# Altium schematic sheet eBox_Peripherals.SchDoc: eBox_Peripherals
size A4; DocumentNumber: 4; SheetNumber: 4; SheetTotal: 9
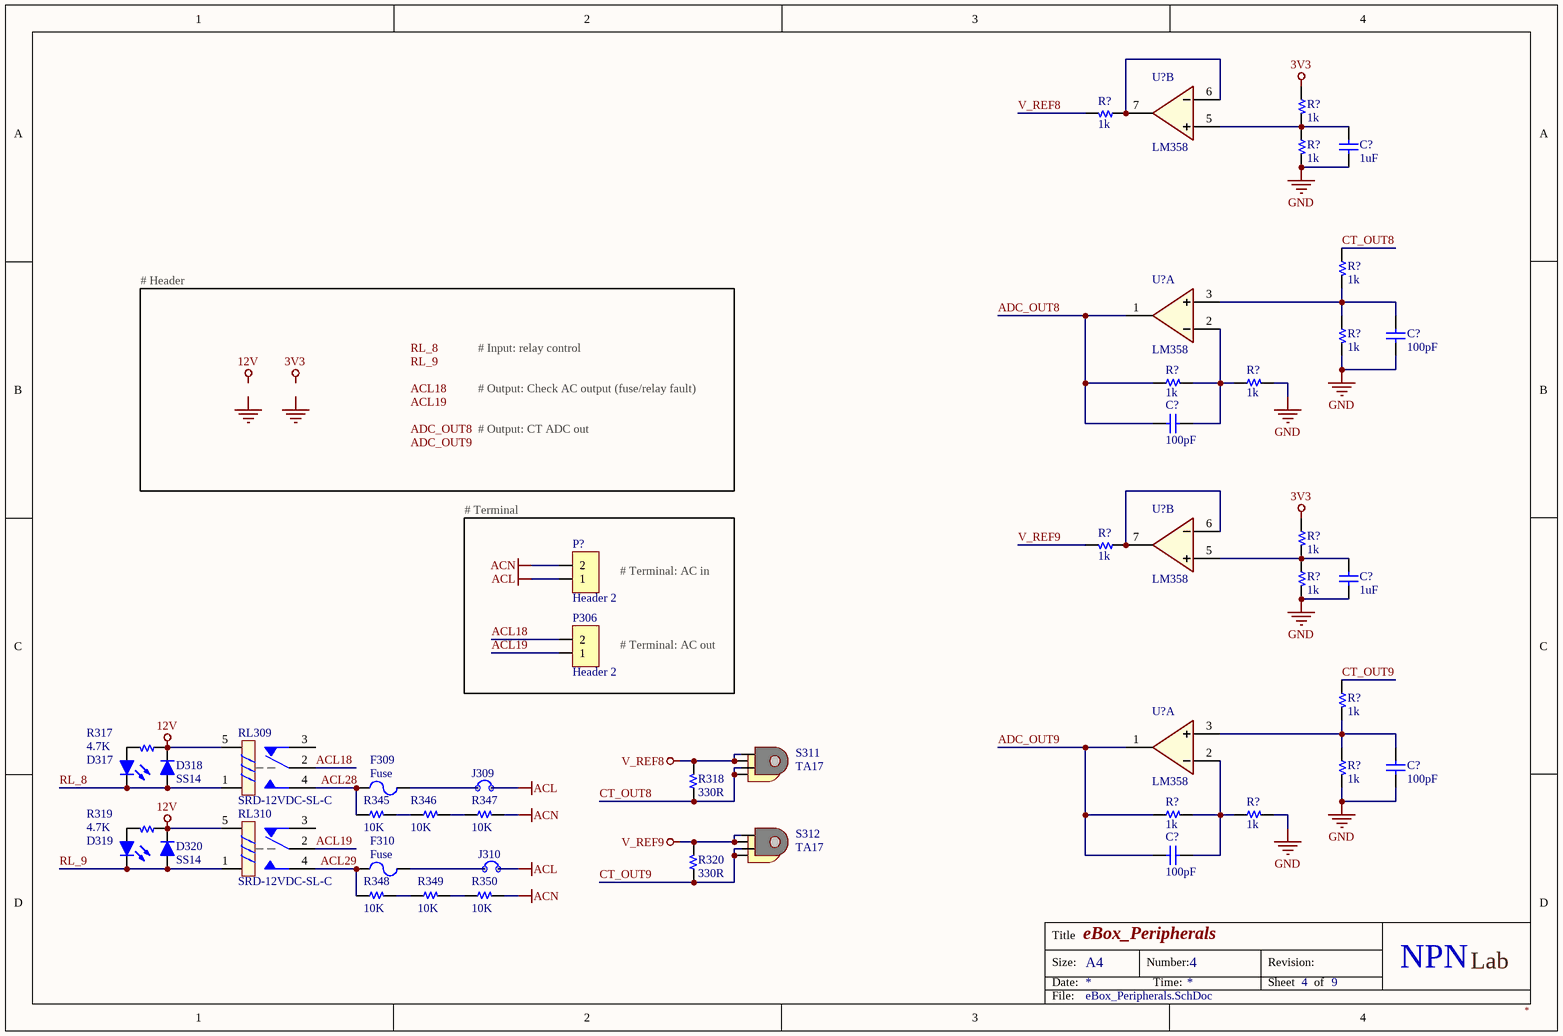
[diagram p0: eBox_Peripherals.SchDoc]

## Parts
(Parts that share a designator on the sheet are numbered #1, #2 ... from top to bottom, then left to right.)
C?#1  1uF  [C 0603]
C?#2  100pF  [C 0603]
C?#3  100pF  [C 0603]
C?#4  1uF  [C 0603]
C?#5  100pF  [C 0603]
C?#6  100pF  [C 0603]
D317  Led  [LED 3MM - green]  (value not drawn)
D318  SS14  [DO-214AC (SMA) L]
D319  Led  [LED 3MM - green]  (value not drawn)
D320  SS14  [DO-214AC (SMA) L]
F309  Fuse  [FUSE 2 DIP 0520 BOX]
F310  Fuse  [FUSE 2 DIP 0520 BOX]
J309  JUMP 2 CUSTOM  [JUMP/2/Custom]  (value not drawn)  (no BOM)
J310  JUMP 2 CUSTOM  [JUMP/2/Custom]  (value not drawn)  (no BOM)
P306  Header 2  [HDR/Terminal/2/10mm]
P?  Header 2  [HDR/Terminal/2/10mm]
R317  4.7K  [R 0805]
R318  330R  [R 0805]
R319  4.7K  [R 0805]
R320  330R  [R 0805]
R345  10K  [R 1206]
R346  10K  [R 1206]
R347  10K  [R 1206]
R348  10K  [R 1206]
R349  10K  [R 1206]
R350  10K  [R 1206]
R?#1  1k  [R 0603]
R?#2  1k  [R 0603]
R?#3  1k  [R 0603]
R?#4  1k  [R 0603]
R?#5  1k  [R 0603]
R?#6  1k  [R 0603]
R?#7  1k  [R 0603]
R?#8  1k  [R 0603]
R?#9  1k  [R 0603]
R?#10  1k  [R 0603]
R?#11  1k  [R 0603]
R?#12  1k  [R 0603]
R?#13  1k  [R 0603]
R?#14  1k  [R 0603]
RL309  SRD-12VDC-SL-C  [RL_SPDT_10A]
RL310  SRD-12VDC-SL-C  [RL_SPDT_10A]
S309  TA12-200  [TA12]  (value not drawn)
S310  NA  [TA12]  (value not drawn)
S311  TA17  [TA17]
S312  TA17  [TA17]
U?#1  LM358  [SOIC-8]  (part B of 2)
U?#2  LM358  [SOIC-8]  (part A of 2)
U?#3  LM358  [SOIC-8]  (part B of 2)
U?#4  LM358  [SOIC-8]  (part A of 2)

## Nets
3V3: R?#2.2 R?#9.2
12V: D318.2(K) D320.2(K) R317.1 R319.1 RL309.5(COIL2) RL310.5(COIL2)
ACL: J309.2 J310.2 P?.1
ACN: P?.2 R347.2 R350.2
GND: C?#1.2 C?#2.2 C?#4.2 C?#5.2 R?#3.1 R?#5.1 R?#7.2 R?#10.1 R?#12.1 R?#14.2 U?#2.4(GND) U?#4.4(GND)
V_REF8: R318.2 R?#1.1 S309.1 S311.1
V_REF9: R320.2 R?#8.1 S310.1 S312.1
VCC: U?#2.8(VCC) U?#4.8(VCC)
ACL18: P306.2 RL309.2(NO)
ACL19: P306.1 RL310.2(NO)
ACL28: F309.1 R345.1 RL309.4(COM)
ACL29: F310.1 R348.1 RL310.4(COM)
ADC_OUT8: C?#3.2 R?#6.1 U?#2.1(OutA)
ADC_OUT9: C?#6.2 R?#13.1 U?#4.1(OutA)
CT_OUT8: R318.1 R?#4.2 S309.2 S311.2
CT_OUT9: R320.1 R?#11.2 S310.2 S312.2
RL_8: D317.2(K) D318.1(A) RL309.1(COIL1)
RL_9: D319.2(K) D320.1(A) RL310.1(COIL1)
NetC?#1_1: C?#1.1 R?#2.1 R?#3.2 U?#1.5(B+)
NetC?#2_1: C?#2.1 R?#4.1 R?#5.2 U?#2.3(A+)
NetC?#3_1: C?#3.1 R?#6.2 R?#7.1 U?#2.2(A-)
NetC?#4_1: C?#4.1 R?#9.1 R?#10.2 U?#3.5(B+)
NetC?#5_1: C?#5.1 R?#11.1 R?#12.2 U?#4.3(A+)
NetC?#6_1: C?#6.1 R?#13.2 R?#14.1 U?#4.2(A-)
NetD317_1: D317.1(A) R317.2
NetD319_1: D319.1(A) R319.2
NetF309_2: F309.2 J309.1
NetF310_2: F310.2 J310.1
NetR345_2: R345.2 R346.1
NetR346_2: R346.2 R347.1
NetR348_2: R348.2 R349.1
NetR349_2: R349.2 R350.1
NetR?#1_2: R?#1.2 U?#1.6(B-) U?#1.7(OutB)
NetR?#8_2: R?#8.2 U?#3.6(B-) U?#3.7(OutB)

Not connected (* = marked no-connect by the designer): RL309 3(NC); RL310 3(NC)

## Notes on the sheet
- # Header
- # Input: relay control
- # Output: Check AC output (fuse/relay fault)
- # Output: CT ADC out
- # Terminal
- (near P?) # Terminal: AC in
- (near P306) # Terminal: AC out
- Labels drawn without touching a wire or pin: 3V3, 12V, ACL18, ACL19, ADC_OUT8, ADC_OUT9, GND, RL_8, RL_9
- Title
- Size:
- Date:
- A4
- Number:
- Time:
- Revision:
- Sheet
- of
- NPN
- Lab
- File:

## Library data of the parts
C?#1-C?#6 = Capacitor NP: Capacitor non-pol
D317 D319 = Led: LED RED CLEAR 0805 SMD; PACKAGE: SMD0805; STOCK CODE: HT17-2102SURC; SUPPLIER: tme.vn; TYPE: SMD; STOCK DESC: SMD-0805 High Bright Red Chip LED; UNIT PRICE: 800
D318 D320 = Diode: DIODE SCHOTTKY 40V 1A SMA; BRAND: Toshiba; TYPE: SMD; PACKAGE: DO-214AC; PART NO: SS14; STOCK CODE: SS14; SUPPLIER: tme.vn; STOCK DESC: 1A 40V Schottky Barrier Diode; UNIT PRICE: 1000
P306 P? = Header 2: Header, 2-Pin; UNIT PRICE: 0
R317 R319 = Resistor: RES SMD 4.7K OHM 1% 1/10W 0805; PACKAGE: SMD0805; STOCK CODE: RM10JTN472; SUPPLIER: tme.vn; TYPE: SMD; STOCK DESC: 4.7K 5% SMD-0805 Resistor; UNIT PRICE: 60
R318 R320 = Resistor: RES SMD 680 OHM 1% 1/10W 0805; PACKAGE: SMD0805; STOCK CODE: RM10JTN681; SUPPLIER: tme.vn; TYPE: SMD; STOCK DESC: 680R 5% SMD-0805 Resistor; UNIT PRICE: 60
R345-R350 = Resistor: RES SMD 10K OHM 5% 1/4W 1206; PACKAGE: SMD1206; SUPPLIER: banlinhkien.com; TYPE: SMD; STOCK DESC: RES SMD 10K OHM 5% 1/4W 1206; UNIT PRICE: 240
R?#1-R?#14 = Resistor
RL309 RL310 = Relay SPDT: RELAY GEN PURPOSE SPDT 10A 12V; BRAND: SONGLE; PART NO: SRD-12VDC-SL-C; STOCK CODE: SRD-12VDC-SL-C; SUPPLIER: tme.vn; TYPE: TH; STOCK DESC: Relay SRD-12VDC-SL-C; UNIT PRICE: 10000
S309 = TA12: CURR SENSE 1:2000 5A T/H; BRAND: YHDC; PART NO: TA12-200; SUPPLIER: CHINA; TYPE: TH; UNIT PRICE: 22328
S310 = TA12: CURR SENSE 1:2000 5A T/H; PART NO: TA12-200; BRAND: YHDC; SUPPLIER: CHINA; TYPE: TH; UNIT PRICE: 22328
U?#1-U?#4 = LM358: Low Power Dual Operational Amplifiers
F309 F310 = Fuse: UNIT PRICE: 0
J309 J310 = JUMP 2 CUSTOM: TYPE: NO-BOM; UNIT PRICE: 0